# EAGLE design Aqua_ph_orp (EAGLE 6.5.0)
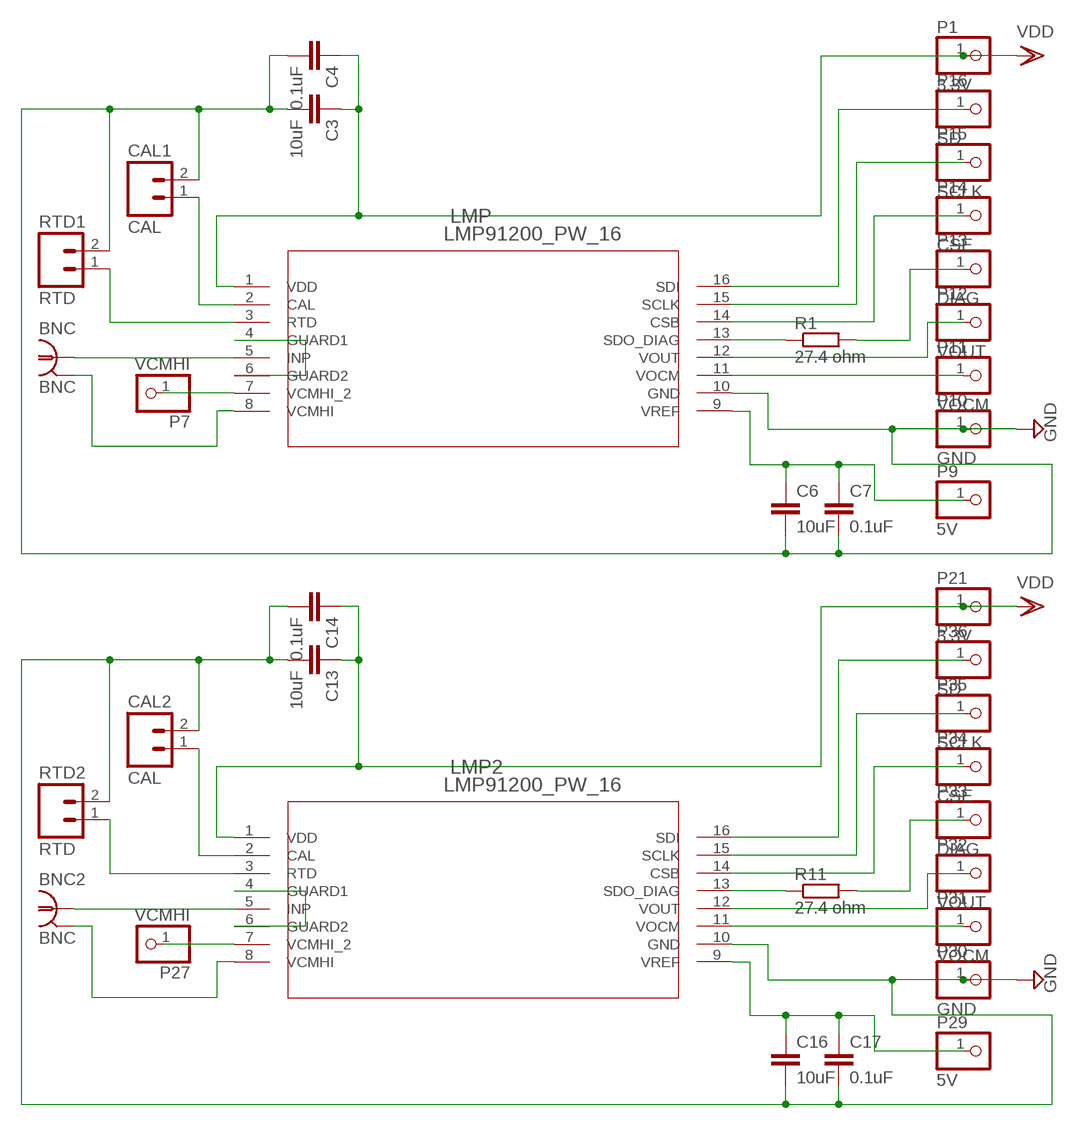
[diagram p0: schematic, sheet 1]

## Parts
BNC  BNC  1-227161-0  [AMP_227161]
BNC2  BNC  1-227161-0  [AMP_227161]
C3  10uF  C-EUC3216  [C3216]
C4  0.1uF  C-EUC0603  [C0603]
C6  10uF  C-EUC3216  [C3216]
C7  0.1uF  C-EUC1206  [C1206]
C13  10uF  C-EUC3216  [C3216]
C14  0.1uF  C-EUC0603  [C0603]
C16  10uF  C-EUC3216  [C3216]
C17  0.1uF  C-EUC1206  [C1206]
CAL1  CAL  M025.08MM  [SCREWTERMINAL-KF-301-2P]
CAL2  CAL  M025.08MM  [SCREWTERMINAL-KF-301-2P]
LMP  LMP91200_PW_16  [MTC16]
LMP2  LMP91200_PW_16  [MTC16]
P1  3.3V  PINHD-1X1  [1X01]
P7  VCMHI  PINHD-1X1  [1X01]
P9  5V  PINHD-1X1  [1X01]
P10  GND  PINHD-1X1  [1X01]
P11  VOCM  PINHD-1X1  [1X01]
P12  VOUT  PINHD-1X1  [1X01]
P13  DIAG  PINHD-1X1  [1X01]
P14  CSE  PINHD-1X1  [1X01]
P15  SCLK  PINHD-1X1  [1X01]
P16  SD  PINHD-1X1  [1X01]
P21  3.3V  PINHD-1X1  [1X01]
P27  VCMHI  PINHD-1X1  [1X01]
P29  5V  PINHD-1X1  [1X01]
P30  GND  PINHD-1X1  [1X01]
P31  VOCM  PINHD-1X1  [1X01]
P32  VOUT  PINHD-1X1  [1X01]
P33  DIAG  PINHD-1X1  [1X01]
P34  CSE  PINHD-1X1  [1X01]
P35  SCLK  PINHD-1X1  [1X01]
P36  SD  PINHD-1X1  [1X01]
R1  27.4 ohm  R-EU_R0603  [R0603]
R11  27.4 ohm  R-EU_R0603  [R0603]
RTD1  RTD  M025.08MM  [SCREWTERMINAL-KF-301-2P]
RTD2  RTD  M025.08MM  [SCREWTERMINAL-KF-301-2P]

## Nets
GND: C3.2 C4.2 C6.2 C7.2 C13.2 C14.2 C16.2 C17.2 CAL1.2 CAL2.2 LMP2.10(GND) LMP.10(GND) P10.1 P30.1 RTD1.2 RTD2.2
N$1: LMP.7(VCMHI_2) P7.1
N$2: BNC.2(GND) LMP.8(VCMHI)
N$3: LMP.4(GUARD1) LMP.6(GUARD2)
N$6: CAL1.1 LMP.2(CAL)
N$7: LMP.3(RTD) RTD1.1
N$8: C6.1 C7.1 LMP.9(VREF) P9.1
N$9: LMP2.14(CSB) P34.1
N$10: LMP2.15(SCLK) P35.1
N$11: LMP2.16(SDI) P36.1
N$12: LMP2.12(VOUT) P32.1
N$13: P33.1 R11.2
N$14: LMP2.11(VOCM) P31.1
N$15: LMP2.13(SDO_DIAG) R11.1
N$16: BNC2.1 LMP2.5(INP)
N$17: LMP2.7(VCMHI_2) P27.1
N$18: BNC2.2(GND) LMP2.8(VCMHI)
N$19: LMP2.4(GUARD1) LMP2.6(GUARD2)
N$20: CAL2.1 LMP2.2(CAL)
N$21: LMP2.3(RTD) RTD2.1
N$22: C16.1 C17.1 LMP2.9(VREF) P29.1
N$66: LMP.14(CSB) P14.1
N$67: LMP.15(SCLK) P15.1
N$68: LMP.16(SDI) P16.1
N$69: LMP.12(VOUT) P12.1
N$70: P13.1 R1.2
N$73: LMP.11(VOCM) P11.1
N$74: LMP.13(SDO_DIAG) R1.1
N$76: BNC.1 LMP.5(INP)
VDD: C3.1 C4.1 C13.1 C14.1 LMP2.1(VDD) LMP.1(VDD) P1.1 P21.1

## Library data of the parts
BNC BNC2 = con-coax:?227161*: JACK, RIGHT ANGLE, 50 OHM, PCB, BNC Source: amp_227161.pdf; MF: TYCO ELECTRONICS; MPN: 1-227161; OC_FARNELL: unknown; OC_NEWARK: 33B3200
C3 C4 C6 C7 C13 C14 C16 C17 = resistor:C-EU: CAPACITOR, European symbol
CAL1 CAL2 RTD1 RTD2 = SparkFun-Connectors:M02: Header 2 Standard 2-pin 0.1" header. Use with straight break away headers (SKU : PRT-00116), right angle break away headers (PRT-00553), swiss pins (PRT-00743), machine pins (PRT-00117), and female headers (PRT-00115). Molex polarized connector foot print use with SKU : PRT-08233 with associated crimp pins and housings.
LMP LMP2 = LMP91200:LMP91200_PW_16; BASEPN: LMP91200; DATASHEETURL: http://www.ti.com/lit/ds/symlink/lmp91200.pdf; DESCRIPTION: Configurable AFE for Low-Power Chemical Sensing Applications; MANUFACTURER: Texas Instruments; MANUFACTURER_PART_NUMBER: lmp91200_pw_16; NSC_PACKAGEREFERENCE: MTC16; VENDOR: Texas Instruments
P1 P7 P9-P16 P21 P27 P29-P36 = pinhead:PINHD-1X1: PIN HEADER
R1 R11 = resistor:R-EU_: RESISTOR, European symbol

## Net classes
0 default: clearance 0.205 mm

## Board
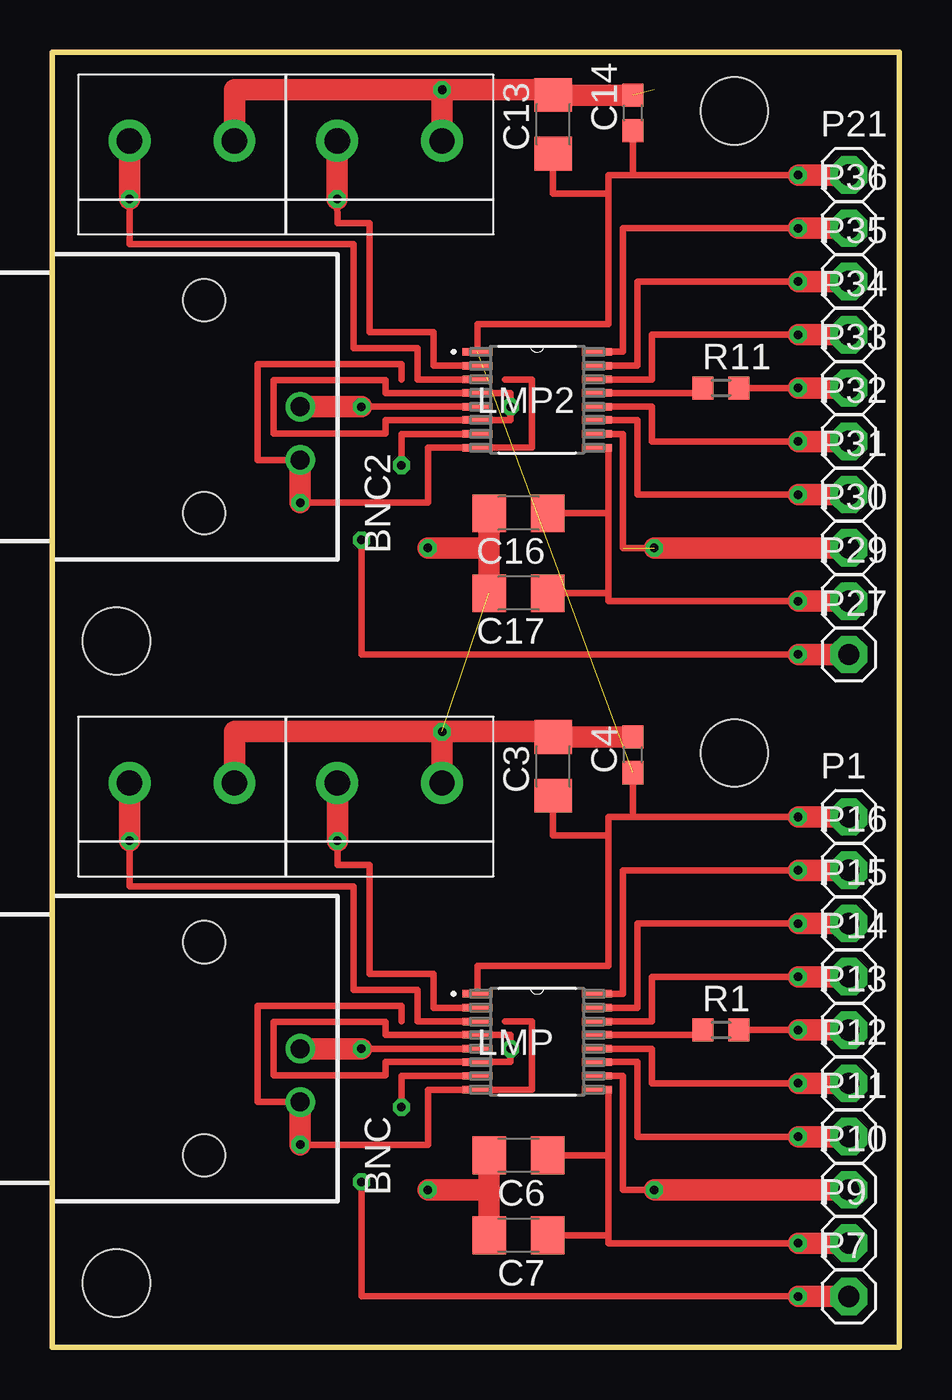
[diagram p1: board, top side]
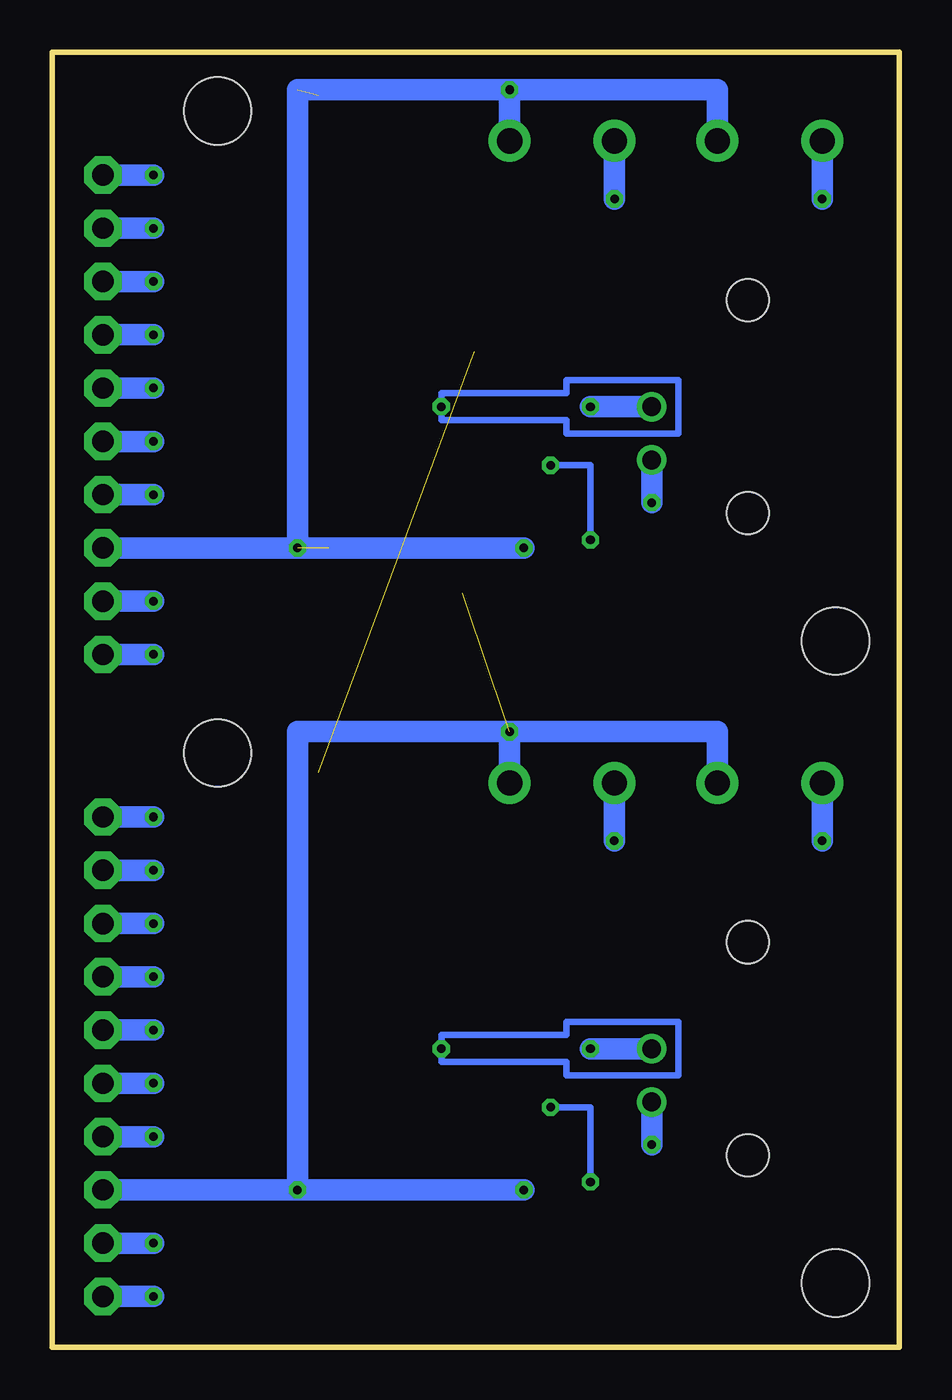
[diagram p2: board, bottom side, seen from below]

Size 40.39 x 61.72 mm. Coordinates in mm from the lower left corner, seen from the top.
Outline: 0,0 40.39,0 40.39,61.72 0,61.72 0,0
Copper layers (1*16): Top 0.035mm / dielectric 1.5mm / Bottom 0.035mm
Design rules "default *": minimum track width 12mil, minimum drill 12mil, track to track 10mil, track to pad 10mil, pad to pad 10mil, via to via 10mil, smd to smd 10mil, copper to edge 40mil, drill to drill 12mil, minimum pad ring 10mil, minimum via ring 8mil, stop-mask expansion 4mil, vias tented up to drill 0mil, thermal gap 10mil
Holes 3.2 mm at 3.05,3.05 32.51,28.32 3.05,33.66 32.51,58.93

### Footprints (pad centres in the part's own frame; a part is rotated, then mirrored left to right if it is on the bottom)
AMP_227161 = drill 0.9 pad 1.27: 1 0,-4.58; 2 -2.54,-4.58 | hole 2: -5.08,0; 5.08,0; -5.08,0; 5.08,0
C3216 = smd 1.6 x 1.8: 1 -1.4,0; 2 1.4,0
C0603 = smd 1.1 x 1: 1 -0.85,0; 2 0.85,0
C1206 = smd 1.6 x 1.8: 1 -1.4,0; 2 1.4,0
SCREWTERMINAL-KF-301-2P = drill 1.2 pad 2: 1 7.5,3.2; 2 2.5,3.2
MTC16 = smd 1.422 x 0.356: 1 -2.845,2.286; 2 -2.845,1.626; 3 -2.845,0.965; 4 -2.845,0.33; 5 -2.845,-0.33; 6 -2.845,-0.965; 7 -2.845,-1.626; 8 -2.845,-2.286; 9 2.845,-2.286; 10 2.845,-1.626; 11 2.845,-0.965; 12 2.845,-0.33; 13 2.845,0.33; 14 2.845,0.965; 15 2.845,1.626; 16 2.845,2.286
1X01 = drill 1.016 pad 1.778 octagon: 1 0,0
R0603 = smd 1 x 1.1: 1 -0.85,0; 2 0.85,0

### Placement (x,y rotation side)
BNC  7.23,14.22 90 top
BNC2  7.23,44.83 90 top
C3  23.88,27.69 90 top
C4  27.69,28.23 90 top
C6  22.23,9.14 180 top
C7  22.23,5.33 180 top
C13  23.88,58.29 90 top
C14  27.69,58.84 90 top
C16  22.23,39.75 180 top
C17  22.23,35.94 180 top
CAL1  21.08,30.1 180 top
CAL2  21.08,60.71 180 top
LMP  23.11,14.55 0 top
LMP2  23.11,45.16 0 top
P1  37.97,25.27 0 top
P7  37.97,2.41 0 top
P9  37.97,4.95 0 top
P10  37.97,7.49 0 top
P11  37.97,10.03 0 top
P12  37.97,12.57 0 top
P13  37.97,15.11 0 top
P14  37.97,17.65 0 top
P15  37.97,20.19 0 top
P16  37.97,22.73 0 top
P21  37.97,55.88 0 top
P27  37.97,33.02 0 top
P29  37.97,35.56 0 top
P30  37.97,38.1 0 top
P31  37.97,40.64 0 top
P32  37.97,43.18 0 top
P33  37.97,45.72 0 top
P34  37.97,48.26 0 top
P35  37.97,50.8 0 top
P36  37.97,53.34 0 top
R1  31.88,15.11 0 top
R11  31.88,45.72 0 top
RTD1  11.18,30.1 180 top
RTD2  11.18,60.71 180 top

### Tracks (layer width: path | path; a pad name or v marks a point on that pad's centre or on a via)
GND  (via drill 0.41)  (3 unrouted)
  Top 0.305: LMP.10 27.2,12.93 27.2,7.49 v28.7,7.49 | LMP2.10 27.2,43.54 27.2,38.1 v28.7,38.1 | C14.2 | C13.2 23.88,59.94
  Top 1.016: v28.7,7.49 P10.1 | C7.2 C6.2 20.82,7.49 | 20.82,7.49 20.83,7.49 20.83,7.24 | 20.82,7.49 v17.91,7.49 | RTD1.2 8.68,29.34 v18.58,29.34 | v18.58,29.34 CAL1.2 | C4.2 27.56,29.08 C3.2 23.5,29.34 v18.58,29.34 | v28.7,38.1 P30.1 | C17.2 C16.2 20.82,38.1 v17.91,38.1 | C14.2 C13.2 | 23.88,59.94 v18.58,59.94 | 18.58,57.53 v18.58,59.94 | 8.68,57.53 8.68,59.94 v18.58,59.94
  Bottom 1.016: P10.1 v28.7,7.49 | v17.91,7.49 v28.7,7.49 | RTD1.2 8.68,29.34 v18.58,29.34 | CAL1.2 18.58,27.15 v18.58,29.34 | v18.58,29.34 28.7,29.34 v28.7,7.49 | v17.91,38.1 v28.7,38.1 | v28.7,38.1 28.7,59.94 v18.58,59.94 | v18.58,59.94 8.68,59.94 RTD2.2 | P30.1 v28.7,38.1 | v18.58,59.94 CAL2.2
N$1  (via drill 0.41)
  Top 0.305: LMP.7 16.64,12.93 v16.64,11.43 | v14.73,7.87 14.73,2.41 v35.56,2.41
  Top 1.016: v35.56,2.41 P7.1
  Bottom 0.305: v16.64,11.43 14.73,11.43 v14.73,7.87
  Bottom 1.016: P7.1 v35.56,2.41
N$2  (via drill 0.41)
  Top 0.305: LMP.8 17.91,12.27 17.91,9.65 v11.81,9.65 | BNC.2 9.78,11.68 9.78,16.26 16.64,16.26 16.64,15.52
  Top 1.016: v11.81,9.65 BNC.2
  Bottom 1.016: BNC.2 v11.81,9.65
N$3
  Top 0.305: LMP.6 15.88,13.59 15.88,12.95 10.54,12.95 10.54,15.49 15.88,15.49 15.88,14.88 LMP.4
N$4  (via drill 0.41)
  Top 0.305: 20.27,14.88 21.84,14.88 v21.84,14.22 21.84,13.59 20.27,13.59
  Bottom 0.305: 21.84,13.59 15.88,13.59 15.88,12.95 10.54,12.95 10.54,15.49 15.88,15.49 15.88,14.88 21.84,14.88 v21.84,14.22 21.84,13.59
N$5
  Top 0.305: 20.19,12.27 22.86,12.27 22.86,15.52 21.59,15.52
N$6  (via drill 0.41)
  Top 0.305: LMP.2 18.16,16.18 18.16,17.78 15.11,17.78 15.11,22.99 13.59,22.99 v13.59,24.13 | 13.59,27.15 CAL1.1
  Top 1.016: v13.59,24.13 13.59,27.15
  Bottom 1.016: 13.59,27.15 v13.59,24.13
N$7  (via drill 0.41)
  Top 0.305: LMP.3 17.4,15.52 17.4,17.02 14.35,17.02 14.35,21.97 3.68,21.97 v3.68,24.13 | 3.68,27.15 RTD1.1
  Top 1.016: v3.68,24.13 3.68,27.15
  Bottom 1.016: 3.68,27.15 v3.68,24.13
N$8  (via drill 0.41)
  Top 0.305: LMP.9 26.52,12.27 26.52,9.14 | 26.52,9.14 26.52,5.33 | 26.52,5.33 26.52,4.95 v35.56,4.95 | C6.1 26.52,9.14 | C7.1 26.52,5.33
  Top 1.016: v35.56,4.95 P9.1
  Bottom 1.016: P9.1 v35.56,4.95
N$9  (via drill 0.41)
  Top 0.305: LMP2.14 28.57,46.13 28.57,48.26 v35.56,48.26
  Top 1.016: v35.56,48.26 P34.1
  Bottom 1.016: P34.1 v35.56,48.26
N$10  (via drill 0.41)
  Top 0.305: LMP2.15 27.89,46.79 27.89,50.8 v35.56,50.8
  Top 1.016: v35.56,50.8 P35.1
  Bottom 1.016: P35.1 v35.56,50.8
N$11  (via drill 0.41)
  Top 0.305: LMP2.16 27.2,47.45 27.2,53.34 v35.56,53.34
  Top 1.016: v35.56,53.34 P36.1
  Bottom 1.016: P36.1 v35.56,53.34
N$12  (via drill 0.41)
  Top 0.305: LMP2.12 28.57,44.83 28.57,43.18 v35.56,43.18
  Top 1.016: v35.56,43.18 P32.1
  Bottom 1.016: P32.1 v35.56,43.18
N$13  (via drill 0.41)
  Top 0.305: R11.2 v35.56,45.72
  Top 1.016: v35.56,45.72 P33.1
  Bottom 1.016: P33.1 v35.56,45.72
N$14  (via drill 0.41)
  Top 0.305: LMP2.11 27.89,44.2 27.89,40.64 v35.56,40.64
  Top 1.016: v35.56,40.64 P31.1
  Bottom 1.016: P31.1 v35.56,40.64
N$15
  Top 0.305: LMP2.13 31.03,45.49 R11.1
N$16  (via drill 0.41)
  Top 0.305: LMP2.5 v14.73,44.83
  Top 1.016: v14.73,44.83 BNC2.1
  Bottom 1.016: BNC2.1 v14.73,44.83
N$17  (via drill 0.41)
  Top 0.305: LMP2.7 16.64,43.54 v16.64,42.04 | v14.73,38.48 14.73,33.02 v35.56,33.02
  Top 1.016: v35.56,33.02 P27.1
  Bottom 0.305: v16.64,42.04 14.73,42.04 v14.73,38.48
  Bottom 1.016: P27.1 v35.56,33.02
N$18  (via drill 0.41)
  Top 0.305: LMP2.8 17.91,42.88 17.91,40.26 v11.81,40.26 | BNC2.2 9.78,42.29 9.78,46.86 16.64,46.86 16.64,46.13
  Top 1.016: v11.81,40.26 BNC2.2
  Bottom 1.016: BNC2.2 v11.81,40.26
N$19  (via drill 0.41)
  Top 0.305: LMP2.4 21.84,45.49 v21.84,44.83 21.84,44.2 LMP2.6 15.88,44.2 15.88,43.56 10.54,43.56 10.54,46.1 15.88,46.1 15.88,45.49 LMP2.4
  Bottom 0.305: 21.84,44.2 15.88,44.2 15.88,43.56 10.54,43.56 10.54,46.1 15.88,46.1 15.88,45.49 21.84,45.49 v21.84,44.83 21.84,44.2
N$20  (via drill 0.41)
  Top 0.305: LMP2.2 18.16,46.79 18.16,48.39 15.11,48.39 15.11,53.59 13.59,53.59 v13.58,54.74
  Top 1.016: CAL2.1 v13.58,54.74
  Bottom 1.016: v13.58,54.74 CAL2.1
N$21  (via drill 0.41)
  Top 0.305: LMP2.3 17.4,46.13 17.4,47.62 14.35,47.62 14.35,52.58 3.68,52.58 v3.68,54.74
  Top 1.016: RTD2.1 v3.68,54.74
  Bottom 1.016: v3.68,54.74 RTD2.1
N$22  (via drill 0.41)
  Top 0.305: LMP2.9 26.52,42.88 26.52,39.75 | 26.52,39.75 26.52,35.94 | 26.52,35.94 26.52,35.56 v35.56,35.56 | C17.1 26.52,35.94 | C16.1 26.52,39.75
  Top 1.016: v35.56,35.56 P29.1
  Bottom 1.016: P29.1 v35.56,35.56
N$24
  Top 0.305: 20.27,42.88 22.86,42.88 22.86,46.13 21.59,46.13
N$66  (via drill 0.41)
  Top 0.305: LMP.14 28.57,15.52 28.57,17.65 v35.56,17.65
  Top 1.016: v35.56,17.65 P14.1
  Bottom 1.016: P14.1 v35.56,17.65
N$67  (via drill 0.41)
  Top 0.305: LMP.15 27.89,16.18 27.89,20.19 v35.56,20.19
  Top 1.016: v35.56,20.19 P15.1
  Bottom 1.016: P15.1 v35.56,20.19
N$68  (via drill 0.41)
  Top 0.305: LMP.16 27.2,16.84 27.2,22.73 v35.56,22.73
  Top 1.016: v35.56,22.73 P16.1
  Bottom 1.016: P16.1 v35.56,22.73
N$69  (via drill 0.41)
  Top 0.305: LMP.12 28.57,14.22 28.57,12.57 v35.56,12.57
  Top 1.016: v35.56,12.57 P12.1
  Bottom 1.016: P12.1 v35.56,12.57
N$70  (via drill 0.41)
  Top 0.305: R1.2 v35.56,15.11
  Top 1.016: v35.56,15.11 P13.1
  Bottom 1.016: P13.1 v35.56,15.11
N$73  (via drill 0.41)
  Top 0.305: LMP.11 27.89,13.59 27.89,10.03 v35.56,10.03
  Top 1.016: v35.56,10.03 P11.1
  Bottom 1.016: P11.1 v35.56,10.03
N$74
  Top 0.305: LMP.13 31.03,14.88 R1.1
N$76  (via drill 0.41)
  Top 0.305: LMP.5 v14.73,14.22
  Top 1.016: v14.73,14.22 BNC.1
  Bottom 0.813: v14.73,14.22 14.61,14.22
  Bottom 1.016: BNC.1 v14.73,14.22
VDD  (via drill 0.41)  (1 unrouted)
  Top 0.305: LMP.1 20.27,18.16 26.52,18.16 26.52,24.38 | 26.52,24.38 26.52,25.27 27.69,25.27 | 27.69,25.27 v35.56,25.27 | C4.1 27.69,25.27 | C3.1 23.88,24.38 26.52,24.38 | LMP2.1 20.27,48.77 26.52,48.77 26.52,54.99 | 26.52,54.99 26.52,55.88 27.69,55.88 | 27.69,55.88 v35.56,55.88 | C14.1 27.69,55.88 | C13.1 23.88,54.99 26.52,54.99
  Top 1.016: v35.56,25.27 P1.1 | v35.56,55.88 P21.1
  Bottom 1.016: P1.1 v35.56,25.27 | P21.1 v35.56,55.88